# EAGLE schematic Precision Dual Layer (EAGLE 6.2)
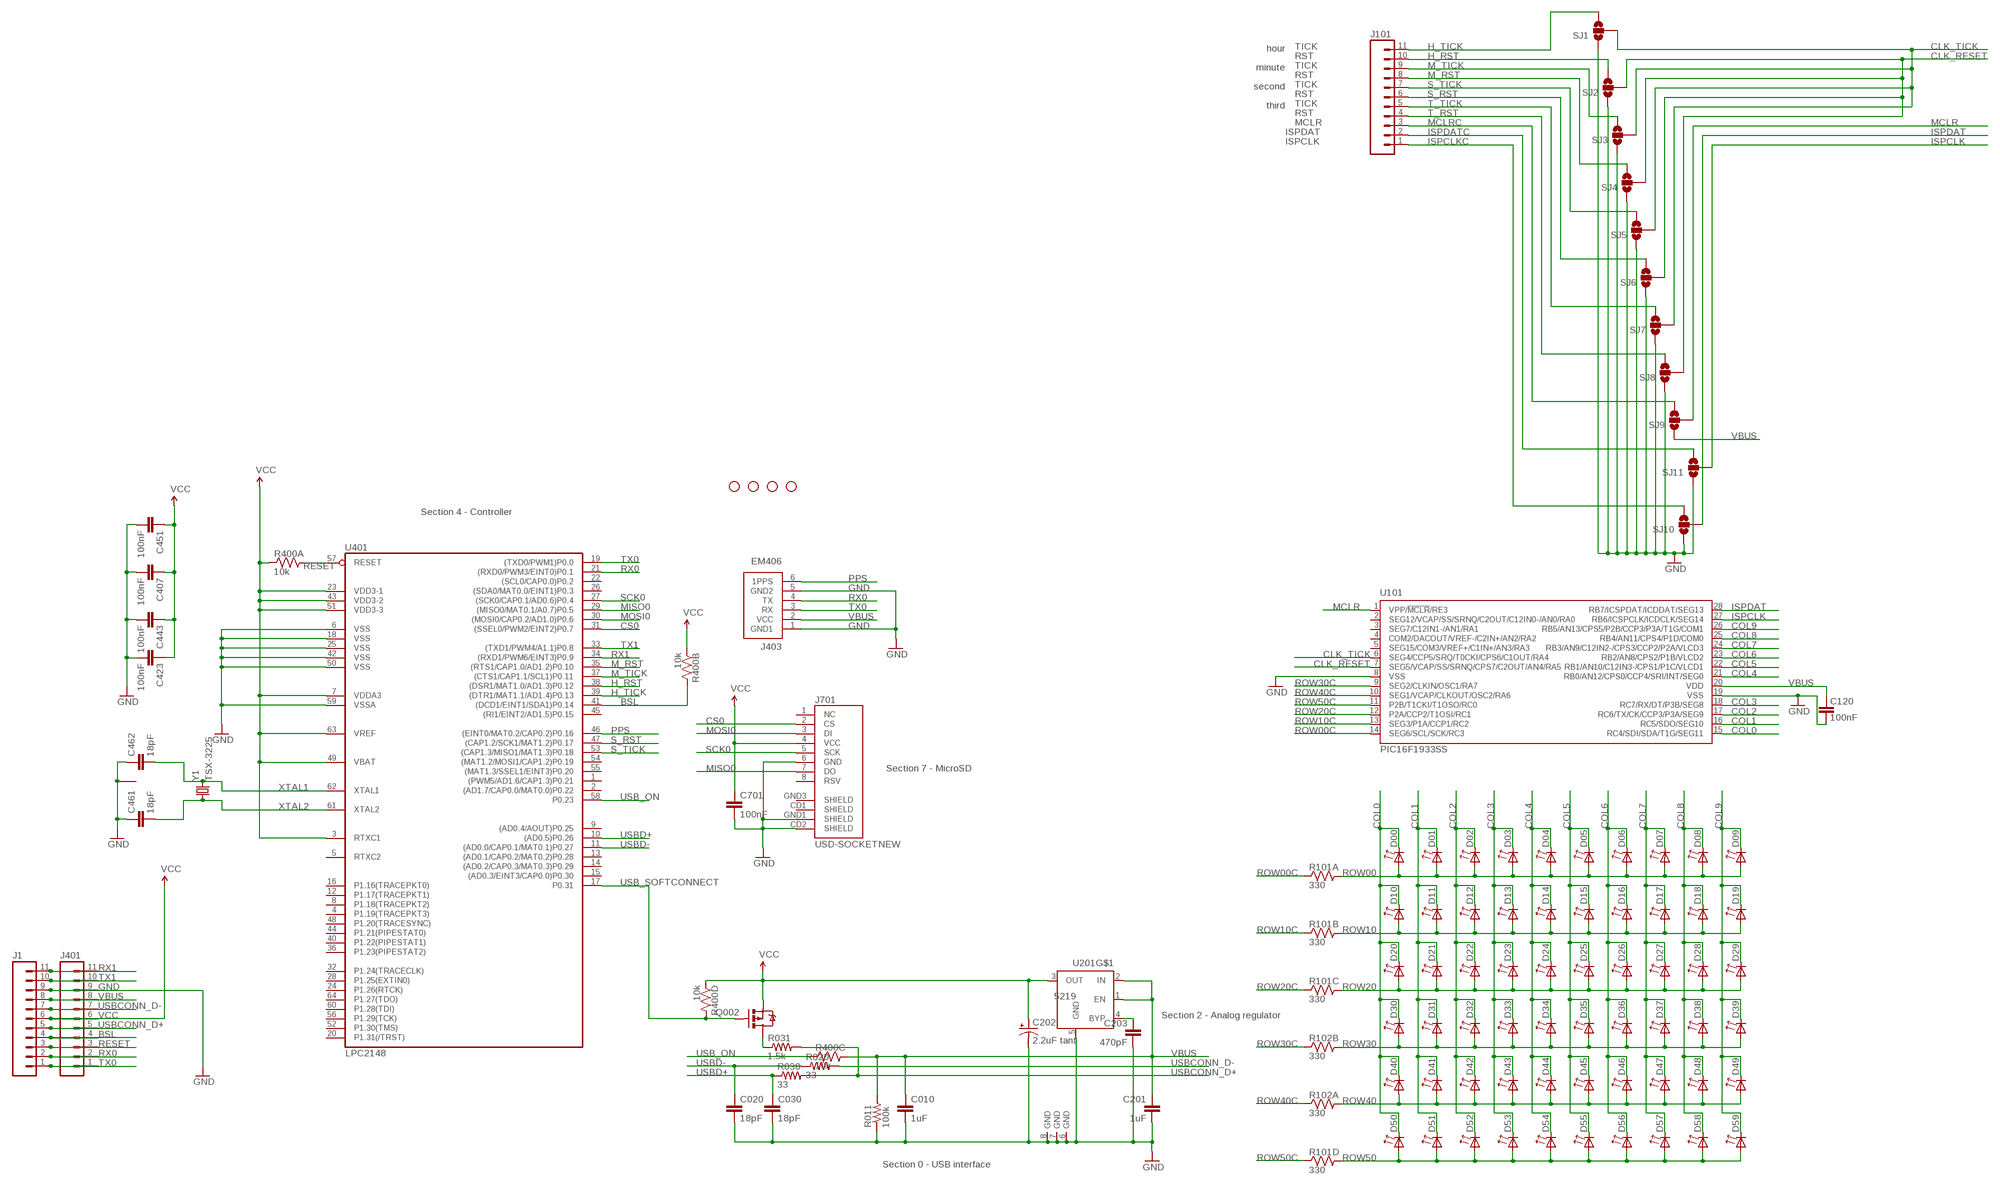
[diagram p0: schematic, sheet 1, part 1 of 2]
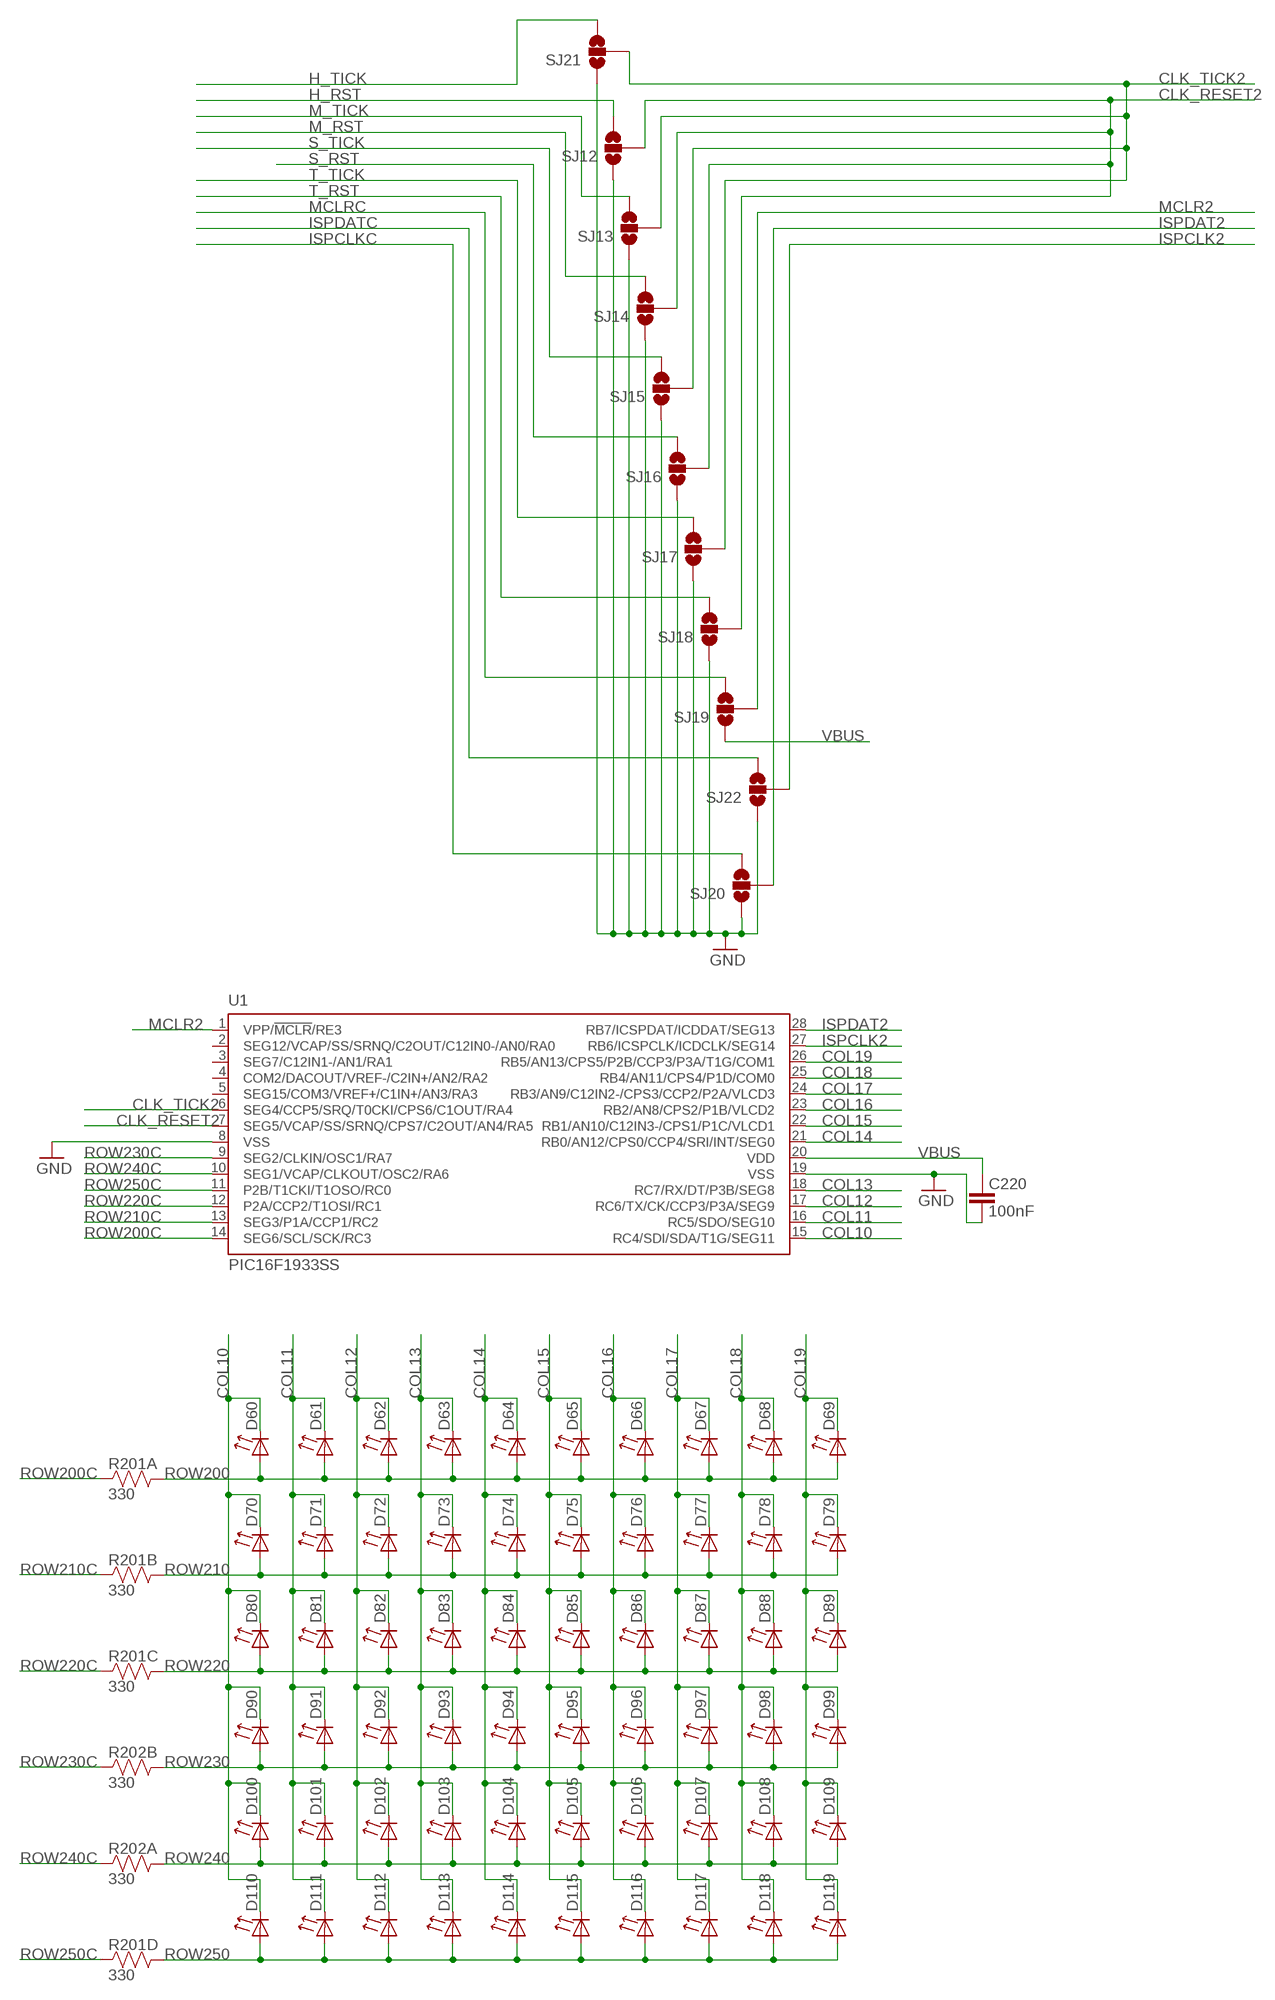
[diagram p1: schematic, sheet 1, part 2 of 2]

## Parts
C010  1uF  CAP0402-CAP  [0402-CAP]
C020  18pF  CAP0402-CAP  [0402-CAP]
C030  18pF  CAP0402-CAP  [0402-CAP]
C120  100nF  CAP0402-CAP  [0402-CAP]
C201  1uF  CAP0402-CAP  [0402-CAP]
C202  2.2uF tant  CAP_POL1206  [EIA3216]
C203  470pF  CAP0402-CAP  [0402-CAP]
C220  100nF  CAP0402-CAP  [0402-CAP]
C407  100nF  CAP0402-CAP  [0402-CAP]
C423  100nF  CAP0402-CAP  [0402-CAP]
C443  100nF  CAP0402-CAP  [0402-CAP]
C451  100nF  CAP0402-CAP  [0402-CAP]
C461  18pF  CAP0402-CAP  [0402-CAP]
C462  18pF  CAP0402-CAP  [0402-CAP]
C701  100nF  CAP0402-CAP  [0402-CAP]
D00  LED0603_SIDE  [LED0603_SIDE]
D01  LED0603_SIDE  [LED0603_SIDE]
D02  LED0603_SIDE  [LED0603_SIDE]
D03  LED0603_SIDE  [LED0603_SIDE]
D04  LED0603_SIDE  [LED0603_SIDE]
D05  LED0603_SIDE  [LED0603_SIDE]
D06  LED0603_SIDE  [LED0603_SIDE]
D07  LED0603_SIDE  [LED0603_SIDE]
D08  LED0603_SIDE  [LED0603_SIDE]
D09  LED0603_SIDE  [LED0603_SIDE]
D10  LED0603_SIDE  [LED0603_SIDE]
D11  LED0603_SIDE  [LED0603_SIDE]
D12  LED0603_SIDE  [LED0603_SIDE]
D13  LED0603_SIDE  [LED0603_SIDE]
D14  LED0603_SIDE  [LED0603_SIDE]
D15  LED0603_SIDE  [LED0603_SIDE]
D16  LED0603_SIDE  [LED0603_SIDE]
D17  LED0603_SIDE  [LED0603_SIDE]
D18  LED0603_SIDE  [LED0603_SIDE]
D19  LED0603_SIDE  [LED0603_SIDE]
D20  LED0603_SIDE  [LED0603_SIDE]
D21  LED0603_SIDE  [LED0603_SIDE]
D22  LED0603_SIDE  [LED0603_SIDE]
D23  LED0603_SIDE  [LED0603_SIDE]
D24  LED0603_SIDE  [LED0603_SIDE]
D25  LED0603_SIDE  [LED0603_SIDE]
D26  LED0603_SIDE  [LED0603_SIDE]
D27  LED0603_SIDE  [LED0603_SIDE]
D28  LED0603_SIDE  [LED0603_SIDE]
D29  LED0603_SIDE  [LED0603_SIDE]
D30  LED0603_SIDE  [LED0603_SIDE]
D31  LED0603_SIDE  [LED0603_SIDE]
D32  LED0603_SIDE  [LED0603_SIDE]
D33  LED0603_SIDE  [LED0603_SIDE]
D34  LED0603_SIDE  [LED0603_SIDE]
D35  LED0603_SIDE  [LED0603_SIDE]
D36  LED0603_SIDE  [LED0603_SIDE]
D37  LED0603_SIDE  [LED0603_SIDE]
D38  LED0603_SIDE  [LED0603_SIDE]
D39  LED0603_SIDE  [LED0603_SIDE]
D40  LED0603_SIDE  [LED0603_SIDE]
D41  LED0603_SIDE  [LED0603_SIDE]
D42  LED0603_SIDE  [LED0603_SIDE]
D43  LED0603_SIDE  [LED0603_SIDE]
D44  LED0603_SIDE  [LED0603_SIDE]
D45  LED0603_SIDE  [LED0603_SIDE]
D46  LED0603_SIDE  [LED0603_SIDE]
D47  LED0603_SIDE  [LED0603_SIDE]
D48  LED0603_SIDE  [LED0603_SIDE]
D49  LED0603_SIDE  [LED0603_SIDE]
D50  LED0603_SIDE  [LED0603_SIDE]
D51  LED0603_SIDE  [LED0603_SIDE]
D52  LED0603_SIDE  [LED0603_SIDE]
D53  LED0603_SIDE  [LED0603_SIDE]
D54  LED0603_SIDE  [LED0603_SIDE]
D55  LED0603_SIDE  [LED0603_SIDE]
D56  LED0603_SIDE  [LED0603_SIDE]
D57  LED0603_SIDE  [LED0603_SIDE]
D58  LED0603_SIDE  [LED0603_SIDE]
D59  LED0603_SIDE  [LED0603_SIDE]
D60  LED0603_SIDE  [LED0603_SIDE]
D61  LED0603_SIDE  [LED0603_SIDE]
D62  LED0603_SIDE  [LED0603_SIDE]
D63  LED0603_SIDE  [LED0603_SIDE]
D64  LED0603_SIDE  [LED0603_SIDE]
D65  LED0603_SIDE  [LED0603_SIDE]
D66  LED0603_SIDE  [LED0603_SIDE]
D67  LED0603_SIDE  [LED0603_SIDE]
D68  LED0603_SIDE  [LED0603_SIDE]
D69  LED0603_SIDE  [LED0603_SIDE]
D70  LED0603_SIDE  [LED0603_SIDE]
D71  LED0603_SIDE  [LED0603_SIDE]
D72  LED0603_SIDE  [LED0603_SIDE]
D73  LED0603_SIDE  [LED0603_SIDE]
D74  LED0603_SIDE  [LED0603_SIDE]
D75  LED0603_SIDE  [LED0603_SIDE]
D76  LED0603_SIDE  [LED0603_SIDE]
D77  LED0603_SIDE  [LED0603_SIDE]
D78  LED0603_SIDE  [LED0603_SIDE]
D79  LED0603_SIDE  [LED0603_SIDE]
D80  LED0603_SIDE  [LED0603_SIDE]
D81  LED0603_SIDE  [LED0603_SIDE]
D82  LED0603_SIDE  [LED0603_SIDE]
D83  LED0603_SIDE  [LED0603_SIDE]
D84  LED0603_SIDE  [LED0603_SIDE]
D85  LED0603_SIDE  [LED0603_SIDE]
D86  LED0603_SIDE  [LED0603_SIDE]
D87  LED0603_SIDE  [LED0603_SIDE]
D88  LED0603_SIDE  [LED0603_SIDE]
D89  LED0603_SIDE  [LED0603_SIDE]
D90  LED0603_SIDE  [LED0603_SIDE]
D91  LED0603_SIDE  [LED0603_SIDE]
D92  LED0603_SIDE  [LED0603_SIDE]
D93  LED0603_SIDE  [LED0603_SIDE]
D94  LED0603_SIDE  [LED0603_SIDE]
D95  LED0603_SIDE  [LED0603_SIDE]
D96  LED0603_SIDE  [LED0603_SIDE]
D97  LED0603_SIDE  [LED0603_SIDE]
D98  LED0603_SIDE  [LED0603_SIDE]
D99  LED0603_SIDE  [LED0603_SIDE]
D100  LED0603_SIDE  [LED0603_SIDE]
D101  LED0603_SIDE  [LED0603_SIDE]
D102  LED0603_SIDE  [LED0603_SIDE]
D103  LED0603_SIDE  [LED0603_SIDE]
D104  LED0603_SIDE  [LED0603_SIDE]
D105  LED0603_SIDE  [LED0603_SIDE]
D106  LED0603_SIDE  [LED0603_SIDE]
D107  LED0603_SIDE  [LED0603_SIDE]
D108  LED0603_SIDE  [LED0603_SIDE]
D109  LED0603_SIDE  [LED0603_SIDE]
D110  LED0603_SIDE  [LED0603_SIDE]
D111  LED0603_SIDE  [LED0603_SIDE]
D112  LED0603_SIDE  [LED0603_SIDE]
D113  LED0603_SIDE  [LED0603_SIDE]
D114  LED0603_SIDE  [LED0603_SIDE]
D115  LED0603_SIDE  [LED0603_SIDE]
D116  LED0603_SIDE  [LED0603_SIDE]
D117  LED0603_SIDE  [LED0603_SIDE]
D118  LED0603_SIDE  [LED0603_SIDE]
D119  LED0603_SIDE  [LED0603_SIDE]
J1  M11PTH  [1X11]
J101  M11PTH  [1X11]
J401  M11PTH  [1X11]
J403  EM406  [EM406@1]
J701  USD-SOCKETNEW  [MICRO-SD-SOCKET-PP]
JP3  STAND-OFF  [STAND-OFF]
JP4  STAND-OFF  [STAND-OFF]
JP5  STAND-OFF  [STAND-OFF]
JP6  STAND-OFF  [STAND-OFF]
Q002  PMOS  MOSFET-PCHANNELSMD  [SOT23-3]
R011  100k  RESISTOR0402-RES  [0402-RES]
R020  33  RESISTOR0402-RES  [0402-RES]
R030  33  RESISTOR0402-RES  [0402-RES]
R031  1.5k  RESISTOR0402-RES  [0402-RES]
R101  330  RP404  [CRA04]
R102  330  RP404  [CRA04]
R201  330  RP404  [CRA04]
R202  330  RP404  [CRA04]
R400  10k  RP404  [CRA04]
SJ1  SOLDERJUMPER_2WAYS  [SJ_3]
SJ2  SOLDERJUMPER_2WAYS  [SJ_3]
SJ3  SOLDERJUMPER_2WAYS  [SJ_3]
SJ4  SOLDERJUMPER_2WAYS  [SJ_3]
SJ5  SOLDERJUMPER_2WAYS  [SJ_3]
SJ6  SOLDERJUMPER_2WAYS  [SJ_3]
SJ7  SOLDERJUMPER_2WAYS  [SJ_3]
SJ8  SOLDERJUMPER_2WAYS  [SJ_3]
SJ9  SOLDERJUMPER_2WAYS  [SJ_3]
SJ10  SOLDERJUMPER_2WAYS  [SJ_3]
SJ11  SOLDERJUMPER_2WAYS  [SJ_3]
SJ12  SOLDERJUMPER_2WAYS  [SJ_3]
SJ13  SOLDERJUMPER_2WAYS  [SJ_3]
SJ14  SOLDERJUMPER_2WAYS  [SJ_3]
SJ15  SOLDERJUMPER_2WAYS  [SJ_3]
SJ16  SOLDERJUMPER_2WAYS  [SJ_3]
SJ17  SOLDERJUMPER_2WAYS  [SJ_3]
SJ18  SOLDERJUMPER_2WAYS  [SJ_3]
SJ19  SOLDERJUMPER_2WAYS  [SJ_3]
SJ20  SOLDERJUMPER_2WAYS  [SJ_3]
SJ21  SOLDERJUMPER_2WAYS  [SJ_3]
SJ22  SOLDERJUMPER_2WAYS  [SJ_3]
U1  PIC16F1933SS  [SSOP28]
U101  PIC16F1933SS  [SSOP28]
U201  5219  MIC5219FMM  [MSOP08]
U401  LPC2148  LPC213X  [SQFP-S-10X10-64]
Y1  TSX-3225  [CRYSTAL_SMD]

## Nets
BSL: J1.4 J401.4 R400.7 U401.41((DCD1/EINT1/SDA1)P0.14)
CLK_RESET: SJ2.2 SJ4.2 SJ6.2 SJ8.2 U101.7(SEG5/VCAP/SS/SRNQ/CPS7/C2OUT/AN4/RA5)
CLK_RESET2: SJ12.2 SJ14.2 SJ16.2 SJ18.2 U1.7(SEG5/VCAP/SS/SRNQ/CPS7/C2OUT/AN4/RA5)
CLK_TICK: SJ1.2 SJ3.2 SJ5.2 SJ7.2 U101.6(SEG4/CCP5/SRQ/T0CKI/CPS6/C1OUT/RA4)
CLK_TICK2: SJ13.2 SJ15.2 SJ17.2 SJ21.2 U1.6(SEG4/CCP5/SRQ/T0CKI/CPS6/C1OUT/RA4)
COL0: D00.C D10.C D20.C D30.C D40.C D50.C U101.15(RC4/SDI/SDA/T1G/SEG11)
COL1: D01.C D11.C D21.C D31.C D41.C D51.C U101.16(RC5/SDO/SEG10)
COL2: D02.C D12.C D22.C D32.C D42.C D52.C U101.17(RC6/TX/CK/CCP3/P3A/SEG9)
COL3: D03.C D13.C D23.C D33.C D43.C D53.C U101.18(RC7/RX/DT/P3B/SEG8)
COL4: D04.C D14.C D24.C D34.C D44.C D54.C U101.21(RB0/AN12/CPS0/CCP4/SRI/INT/SEG0)
COL5: D05.C D15.C D25.C D35.C D45.C D55.C U101.22(RB1/AN10/C12IN3-/CPS1/P1C/VLCD1)
COL6: D06.C D16.C D26.C D36.C D46.C D56.C U101.23(RB2/AN8/CPS2/P1B/VLCD2)
COL7: D07.C D17.C D27.C D37.C D47.C D57.C U101.24(RB3/AN9/C12IN2-/CPS3/CCP2/P2A/VLCD3)
COL8: D08.C D18.C D28.C D38.C D48.C D58.C U101.25(RB4/AN11/CPS4/P1D/COM0)
COL9: D09.C D19.C D29.C D39.C D49.C D59.C U101.26(RB5/AN13/CPS5/P2B/CCP3/P3A/T1G/COM1)
COL10: D60.C D70.C D80.C D90.C D100.C D110.C U1.15(RC4/SDI/SDA/T1G/SEG11)
COL11: D61.C D71.C D81.C D91.C D101.C D111.C U1.16(RC5/SDO/SEG10)
COL12: D62.C D72.C D82.C D92.C D102.C D112.C U1.17(RC6/TX/CK/CCP3/P3A/SEG9)
COL13: D63.C D73.C D83.C D93.C D103.C D113.C U1.18(RC7/RX/DT/P3B/SEG8)
COL14: D64.C D74.C D84.C D94.C D104.C D114.C U1.21(RB0/AN12/CPS0/CCP4/SRI/INT/SEG0)
COL15: D65.C D75.C D85.C D95.C D105.C D115.C U1.22(RB1/AN10/C12IN3-/CPS1/P1C/VLCD1)
COL16: D66.C D76.C D86.C D96.C D106.C D116.C U1.23(RB2/AN8/CPS2/P1B/VLCD2)
COL17: D67.C D77.C D87.C D97.C D107.C D117.C U1.24(RB3/AN9/C12IN2-/CPS3/CCP2/P2A/VLCD3)
COL18: D68.C D78.C D88.C D98.C D108.C D118.C U1.25(RB4/AN11/CPS4/P1D/COM0)
COL19: D69.C D79.C D89.C D99.C D109.C D119.C U1.26(RB5/AN13/CPS5/P2B/CCP3/P3A/T1G/COM1)
CS0: J701.2(CS) U401.31((SSEL0/PWM2/EINT2)P0.7)
GND [power]: C010.2 C020.2 C030.2 C120.1 C201.2 C202.C(-) C203.2 C220.1 C407.2 C423.2 C443.2 C451.2 C461.1 C462.1 C701.2 J1.9 J401.9 J403.1(GND1) J403.5(GND2) J701.6(GND) J701.CD2(SHIELD) J701.GND1(SHIELD) R011.1 SJ1.1 SJ2.1 SJ3.1 SJ4.1 SJ5.1 SJ6.1 SJ7.1 SJ8.1 SJ10.1 SJ11.1 SJ12.1 SJ13.1 SJ14.1 SJ15.1 SJ16.1 SJ17.1 SJ18.1 SJ20.1 SJ21.1 SJ22.1 U1.8(VSS) U1.19(VSS) U101.8(VSS) U101.19(VSS) U201.5(GND) U201.6(GND) U201.7(GND) U201.8(GND) U401.6(VSS) U401.18(VSS) U401.25(VSS) U401.42(VSS) U401.50(VSS) U401.59(VSSA) Y1.2 Y1.4
H_RST: J101.10 SJ2.3 SJ12.3 U401.38((DSR1/MAT1.0/AD1.3)P0.12)
H_TICK: J101.11 SJ1.3 SJ21.3 U401.39((DTR1/MAT1.1/AD1.4)P0.13)
ISPCLK: SJ11.2 U101.27(RB6/ICSPCLK/ICDCLK/SEG14)
ISPCLK2: SJ22.2 U1.27(RB6/ICSPCLK/ICDCLK/SEG14)
ISPCLKC: J101.2 SJ11.3 SJ22.3
ISPDAT: SJ10.2 U101.28(RB7/ICSPDAT/ICDDAT/SEG13)
ISPDAT2: SJ20.2 U1.28(RB7/ICSPDAT/ICDDAT/SEG13)
ISPDATC: J101.1 SJ10.3 SJ20.3
M_RST: J101.8 SJ4.3 SJ14.3 U401.35((RTS1/CAP1.0/AD1.2)P0.10)
M_TICK: J101.9 SJ3.3 SJ13.3 U401.37((CTS1/CAP1.1/SCL1)P0.11)
MCLR: SJ9.2 U101.1(VPP/!MCLR!/RE3)
MCLR2: SJ19.2 U1.1(VPP/!MCLR!/RE3)
MCLRC: J101.3 SJ9.3 SJ19.3
MISO0: J701.7(DO) U401.29((MISO0/MAT0.1/A0.7)P0.5)
MOSI0: J701.3(DI) U401.30((MOSI0/CAP0.2/AD1.0)P0.6)
N$3: C203.1 U201.4(BYP)
PPS: J403.6(1PPS) U401.46((EINT0/MAT0.2/CAP0.2)P0.16)
QDRAIN: Q002.3(D) R031.1
RESET: J1.3 J401.3 R400.8 U401.57(RESET)
ROW00: D00.A D01.A D02.A D03.A D04.A D05.A D06.A D07.A D08.A D09.A R101.8
ROW00C: R101.1 U101.14(SEG6/SCL/SCK/RC3)
ROW10: D10.A D11.A D12.A D13.A D14.A D15.A D16.A D17.A D18.A D19.A R101.7
ROW10C: R101.2 U101.13(SEG3/P1A/CCP1/RC2)
ROW20: D20.A D21.A D22.A D23.A D24.A D25.A D26.A D27.A D28.A D29.A R101.6
ROW20C: R101.3 U101.12(P2A/CCP2/T1OSI/RC1)
ROW30: D30.A D31.A D32.A D33.A D34.A D35.A D36.A D37.A D38.A D39.A R102.7
ROW30C: R102.2 U101.9(SEG2/CLKIN/OSC1/RA7)
ROW40: D40.A D41.A D42.A D43.A D44.A D45.A D46.A D47.A D48.A D49.A R102.8
ROW40C: R102.1 U101.10(SEG1/VCAP/CLKOUT/OSC2/RA6)
ROW50: D50.A D51.A D52.A D53.A D54.A D55.A D56.A D57.A D58.A D59.A R101.5
ROW50C: R101.4 U101.11(P2B/T1CKI/T1OSO/RC0)
ROW200: D60.A D61.A D62.A D63.A D64.A D65.A D66.A D67.A D68.A D69.A R201.8
ROW200C: R201.1 U1.14(SEG6/SCL/SCK/RC3)
ROW210: D70.A D71.A D72.A D73.A D74.A D75.A D76.A D77.A D78.A D79.A R201.7
ROW210C: R201.2 U1.13(SEG3/P1A/CCP1/RC2)
ROW220: D80.A D81.A D82.A D83.A D84.A D85.A D86.A D87.A D88.A D89.A R201.6
ROW220C: R201.3 U1.12(P2A/CCP2/T1OSI/RC1)
ROW230: D90.A D91.A D92.A D93.A D94.A D95.A D96.A D97.A D98.A D99.A R202.7
ROW230C: R202.2 U1.9(SEG2/CLKIN/OSC1/RA7)
ROW240: D100.A D101.A D102.A D103.A D104.A D105.A D106.A D107.A D108.A D109.A R202.8
ROW240C: R202.1 U1.10(SEG1/VCAP/CLKOUT/OSC2/RA6)
ROW250: D110.A D111.A D112.A D113.A D114.A D115.A D116.A D117.A D118.A D119.A R201.5
ROW250C: R201.4 U1.11(P2B/T1CKI/T1OSO/RC0)
RX0: J1.2 J401.2 J403.4(TX) U401.21((RXD0/PWM3/EINT0)P0.1)
RX1: J1.11 J401.11 U401.34((RXD1/PWM6/EINT3)P0.9)
S_RST: J101.6 SJ6.3 SJ16.3 U401.47((CAP1.2/SCK1/MAT1.2)P0.17)
S_TICK: J101.7 SJ5.3 SJ15.3 U401.53((CAP1.3/MISO1/MAT1.3)P0.18)
SCK0: J701.5(SCK) U401.27((SCK0/CAP0.1/AD0.6)P0.4)
T_RST: J101.4 SJ8.3 SJ18.3
T_TICK: J101.5 SJ7.3 SJ17.3
TX0: J1.1 J401.1 J403.3(RX) U401.19((TXD0/PWM1)P0.0)
TX1: J1.10 J401.10 U401.33((TXD1/PWM4/A1.1)P0.8)
USB_ON: R400.3 U401.58(P0.23)
USB_SOFTCONNECT: Q002.1(G) R400.5 U401.17(P0.31)
USBCONN_D+: J1.5 J401.5 R030.2 R031.2
USBCONN_D-: J1.7 J401.7 R020.2
USBD+: C030.1 R030.1 U401.10((AD0.5)P0.26)
USBD-: C020.1 R020.1 U401.11((AD0.0/CAP0.1/MAT0.1)P0.27)
VBUS: C010.1 C120.2 C201.1 C220.2 J1.8 J401.8 J403.2(VCC) R011.2 R400.6 SJ9.1 SJ19.1 U1.20(VDD) U101.20(VDD) U201.1(EN) U201.2(IN)
VCC [power]: C202.A(+) C407.1 C423.1 C443.1 C451.1 C701.1 J1.6 J401.6 J701.4(VCC) Q002.2(S) R400.1 R400.2 R400.4 U201.3(OUT) U401.3(RTXC1) U401.7(VDDA3) U401.23(VDD3-1) U401.43(VDD3-2) U401.49(VBAT) U401.51(VDD3-3) U401.63(VREF)
XTAL1: C462.2 U401.62(XTAL1) Y1.3
XTAL2: C461.2 U401.61(XTAL2) Y1.1
Unconnected: J701.1(NC) J701.8(RSV) J701.CD1(SHIELD) J701.GND3(SHIELD) R102.3 R102.4 R102.5 R102.6 R202.3 R202.4 R202.5 R202.6 U1.2(SEG12/VCAP/SS/SRNQ/C2OUT/C12IN0-/AN0/RA0) U1.3(SEG7/C12IN1-/AN1/RA1) U1.4(COM2/DACOUT/VREF-/C2IN+/AN2/RA2) U1.5(SEG15/COM3/VREF+/C1IN+/AN3/RA3) U101.2(SEG12/VCAP/SS/SRNQ/C2OUT/C12IN0-/AN0/RA0) U101.3(SEG7/C12IN1-/AN1/RA1) U101.4(COM2/DACOUT/VREF-/C2IN+/AN2/RA2) U101.5(SEG15/COM3/VREF+/C1IN+/AN3/RA3) U401.1((PWM5/AD1.6/CAP1.3)P0.21) U401.2((AD1.7/CAP0.0/MAT0.0)P0.22) U401.4(P1.19(TRACEPKT3)) U401.5(RTXC2) U401.8(P1.18(TRACEPKT2)) U401.9((AD0.4/AOUT)P0.25) U401.12(P1.17(TRACEPKT1)) U401.13((AD0.1/CAP0.2/MAT0.2)P0.28) U401.14((AD0.2/CAP0.3/MAT0.3)P0.29) U401.15((AD0.3/EINT3/CAP0.0)P0.30) U401.16(P1.16(TRACEPKT0)) U401.20(P1.31(/TRST)) U401.22((SCL0/CAP0.0)P0.2) U401.24(P1.26(RTCK)) U401.26((SDA0/MAT0.0/EINT1)P0.3) U401.28(P1.25(EXTIN0)) U401.32(P1.24(TRACECLK)) U401.36(P1.23(PIPESTAT2)) U401.40(P1.22(PIPESTAT1)) U401.44(P1.21(PIPESTAT0)) U401.45((RI1/EINT2/AD1.5)P0.15) U401.48(P1.20(TRACESYNC)) U401.52(P1.30(TMS)) U401.54((MAT1.2/MOSI1/CAP1.2)P0.19) U401.55((MAT1.3/SSEL1/EINT3)P0.20) U401.56(P1.29(TCK)) U401.60(P1.28(TDI)) U401.64(P1.27(TDO))

## Notes on the sheet
- hour
- TICK
- RST
- minute
- TICK
- RST
- second
- TICK
- RST
- third
- TICK
- RST
- MCLR
- ISPDAT
- ISPCLK
- Section 4 - Controller
- Section 7 - MicroSD
- Section 2 - Analog regulator
- Section 0 - USB interface

## Library data of the parts
C010 C020 C030 C120 C201 C203 C220 C407 C423 C443 C451 C461 C462 C701 = SparkFun:CAP: Capacitor Standard 0603 ceramic capacitor, and 0.1" leaded capacitor.
C202 = SparkFun:CAP_POL: Capacitor Polarized These are standard SMD and PTH capacitors. Normally 10uF, 47uF, and 100uF in electrolytic and tantalum varieties. Always verify the external diameter of the through hole cap, it varies with capacity, voltage, and manufacturer. The EIA devices should be standard.
D00 D01-D09 D10-D119 = KwanSystems:LED0603_SIDE
J1 J101 J401 = SparkFun:M11: Header 11 Standard 11-pin 0.1" header. Use with straight break away headers (SKU : PRT-00116), right angle break away headers (PRT-00553), swiss pins (PRT-00743), machine pins (PRT-00117), and female headers (PRT-00115).
J403 = SparkFun:EM406: EM406 Connector Proven layout and schematic for EM406 connector. Spark Fun Electronics SKU : GPS-00579
J701 = SparkFun:USD-SOCKET: microSD Socket Push-push type uSD socket. Schematic element and footprint production proven. Spark Fun Electronics SKU : PRT-00127. tDoc lines correctly indicate media card edge positions when inserting (unlocked, locked, depressed).
JP3-JP6 = SparkFun:STAND-OFF: Stand Off This is the mechanical footprint for a #4 phillips button head screw. Use the keepout ring to avoid running the screw head into surrounding components. SKU : PRT-00447
Q002 = SparkFun:MOSFET-PCHANNEL
R011 R020 R030 R031 = SparkFun:RESISTOR: Resistor Basic schematic elements and footprints for 0603, 1206, and PTH resistors.
R101 R102 R201 R202 R400 = KwanSystems:RP4
SJ1-SJ22 = SparkFun:SOLDERJUMPER_2WAY: Solder Jumper 2 way solder jumper
U1 U101 = microchip:PIC16F19*: Flash-Based, 8-Bit CMOS Microcontrollers wtih LCD Driver and nanoWatt XLP Technology Auto generated by make-symbol-device-package-bsdl.ulp Rev. 33 Source: http://ww1.microchip.com/downloads/en/DeviceDoc/41364D.pdf; MPN: PIC16F1933T-I/SS; OC_FARNELL: 1755815; OC_NEWARK: 08R1942
U201 = v-reg-micrel:MIC5219FMM: VOLTAGE REGULATOR; OC_FARNELL: unknown; OC_NEWARK: unknown
U401 = SparkFun:LPC213X: LPC213x Schematic element and footprint for NXP LPC213x. Spark Fun Electronics SKU : COM-00520
Y1 = KwanSystems:TSX-3225

## Net classes
0 default: width 0.152 mm, drill 0.33 mm, clearance 0.152 mm
1 power: width 0.152 mm, drill 0.33 mm, clearance 0.152 mm
2 hv: width 0.152 mm, drill 0.33 mm, clearance 0.152 mm